# Altium schematic sheet Decoupling_caps.SchDoc: SVPXFMC Carrier 3U
size A4; CheckedBy: \; Author: G.Kasprowicz; CompanyName: ISE; DrawnBy: T.Przywozki; Organization: WUT ISE; Address1: Warsaw University of Technology; Address2: Nowowiejska 15/19 00-665 Warsaw; Revision: 1.0.; SheetNumber: 3; SheetTotal: 20; Projet: SVPXFMC Carrier 3U; ModifiedBy: -; CreateDate: XX/XX/XXXX; CheckedDate: -; Title2: Decoupling Caps; DivGrp: ISE; Designer: G. Kasprowicz; Project: SVPXFMC Carrier 3U
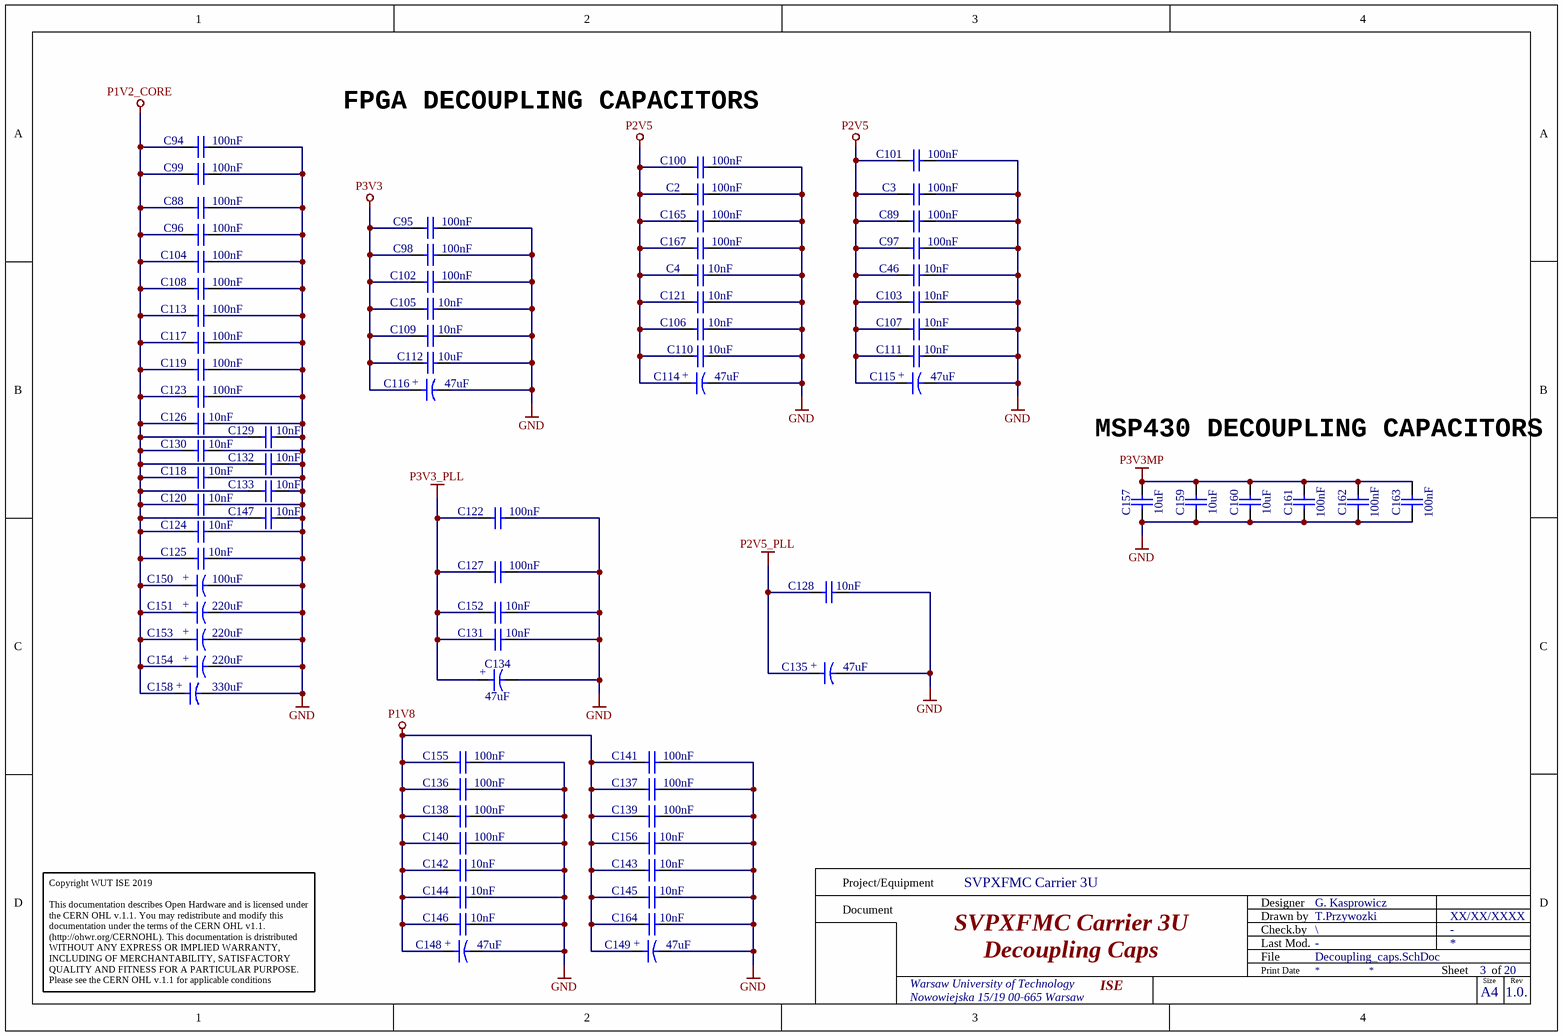
[diagram p0: Decoupling_caps.SchDoc]

## Parts
C2  100nF  [CAPC0603X33N]
C3  100nF  [CAPC0603X33N]
C4  10nF  [CAPC0603X33N]
C46  10nF  [CAPC0603X33N]
C88  100nF  [CAPC0603X33N]
C89  100nF  [CAPC0603X33N]
C94  100nF  [CAPC0603X33N]
C95  100nF  [CAPC0603X33N]
C96  100nF  [CAPC0603X33N]
C97  100nF  [CAPC0603X33N]
C98  100nF  [CAPC0603X33N]
C99  100nF  [CAPC0603X33N]
C100  100nF  [CAPC0603X33N]
C101  100nF  [CAPC0603X33N]
C102  100nF  [CAPC0603X33N]
C103  10nF  [CAPC0603X33N]
C104  100nF  [CAPC0603X33N]
C105  10nF  [CAPC0603X33N]
C106  10nF  [CAPC0603X33N]
C107  10nF  [CAPC0603X33N]
C108  100nF  [CAPC0603X33N]
C109  10nF  [CAPC0603X33N]
C110  10uF  [CAPC2012X135N]
C111  10nF  [CAPC0603X33N]
C112  10uF  [CAPC2012X135N]
C113  100nF  [CAPC0603X33N]
C114  47uF  [CAPMP3528X210N]
C115  47uF  [CAPMP3528X210N]
C116  47uF  [CAPMP3528X210N]
C117  100nF  [CAPC0603X33N]
C118  10nF  [CAPC0603X33N]
C119  100nF  [CAPC0603X33N]
C120  10nF  [CAPC0603X33N]
C121  10nF  [CAPC0603X33N]
C122  100nF  [CAPC0603X33N]
C123  100nF  [CAPC0603X33N]
C124  10nF  [CAPC0603X33N]
C125  10nF  [CAPC0603X33N]
C126  10nF  [CAPC0603X33N]
C127  100nF  [CAPC0603X33N]
C128  10nF  [CAPC0603X33N]
C129  10nF  [CAPC0603X33N]
C130  10nF  [CAPC0603X33N]
C131  10nF  [CAPC0603X33N]
C132  10nF  [CAPC0603X33N]
C133  10nF  [CAPC0603X33N]
C134  47uF  [CAPMP3528X210N]
C135  47uF  [CAPMP3528X210N]
C136  100nF  [CAPC0603X33N]
C137  100nF  [CAPC0603X33N]
C138  100nF  [CAPC0603X33N]
C139  100nF  [CAPC0603X33N]
C140  100nF  [CAPC0603X33N]
C141  100nF  [CAPC0603X33N]
C142  10nF  [CAPC0603X33N]
C143  10nF  [CAPC0603X33N]
C144  10nF  [CAPC0603X33N]
C145  10nF  [CAPC0603X33N]
C146  10nF  [CAPC0603X33N]
C147  10nF  [CAPC0603X33N]
C148  47uF  [CAPMP3528X210N]
C149  47uF  [CAPMP3528X210N]
C150  100uF  [CAPMP3528X210N]
C151  220uF  [CAPMP7343X310N]
C152  10nF  [CAPC0603X33N]
C153  220uF  [CAPMP7343X310N]
C154  220uF  [CAPMP7343X310N]
C155  100nF  [CAPC0603X33N]
C156  10nF  [CAPC0603X33N]
C157  10uF  [CAPC1608X80N]
C158  330uF  [CAPMP7343X310N]
C159  10uF  [CAPC1608X80N]
C160  10uF  [CAPC1608X80N]
C161  100nF  [CAPC1005X55N]
C162  100nF  [CAPC1005X55N]
C163  100nF  [CAPC1005X55N]
C164  10nF  [CAPC0603X33N]
C165  100nF  [CAPC0603X33N]
C167  100nF  [CAPC0603X33N]

## Nets
GND: C2.2 C3.2 C4.2 C46.2 C88.2 C89.2 C94.2 C95.2 C96.2 C97.2 C98.2 C99.2 C100.2 C101.2 C102.2 C103.2 C104.2 C105.2 C106.2 C107.2 C108.2 C109.2 C110.2 C111.2 C112.2 C113.2 C114.2 C115.2 C116.2 C117.2 C118.2 C119.2 C120.2 C121.2 C122.2 C123.2 C124.2 C125.2 C126.2 C127.2 C128.2 C129.2 C130.2 C131.2 C132.2 C133.2 C134.2 C135.2 C136.2 C137.2 C138.2 C139.2 C140.2 C141.2 C142.2 C143.2 C144.2 C145.2 C146.2 C147.2 C148.2 C149.2 C150.2 C151.2 C152.2 C153.2 C154.2 C155.2 C156.2 C157.1 C158.2 C159.1 C160.1 C161.1 C162.1 C163.1 C164.2 C165.2 C167.2
P1V2_CORE: C88.1 C94.1 C96.1 C99.1 C104.1 C108.1 C113.1 C117.1 C118.1 C119.1 C120.1 C123.1 C124.1 C125.1 C126.1 C129.1 C130.1 C132.1 C133.1 C147.1 C150.1 C151.1 C153.1 C154.1 C158.1
P1V8: C136.1 C137.1 C138.1 C139.1 C140.1 C141.1 C142.1 C143.1 C144.1 C145.1 C146.1 C148.1 C149.1 C155.1 C156.1 C164.1
P2V5: C2.1 C3.1 C4.1 C46.1 C89.1 C97.1 C100.1 C101.1 C103.1 C106.1 C107.1 C110.1 C111.1 C114.1 C115.1 C121.1 C165.1 C167.1
P2V5_PLL: C128.1 C135.1
P3V3: C95.1 C98.1 C102.1 C105.1 C109.1 C112.1 C116.1
P3V3_PLL: C122.1 C127.1 C131.1 C134.1 C152.1
P3V3MP: C157.2 C159.2 C160.2 C161.2 C162.2 C163.2

## Notes on the sheet
- FPGA DECOUPLING CAPACITORS
- MSP430 DECOUPLING CAPACITORS
- Project/Equipment
- Document
- Designer
- Drawn by
- Check.by
- Copyright WUT ISE 2019
  This documentation describes Open Hardware and is licensed under the CERN OHL v.1.1. You may redistribute and modify this documentation under the terms of the CERN OHL v1.1.
  (http://ohwr.org/CERNOHL). This documentation is dristributed WITHOUT ANY EXPRESS OR IMPLIED WARRANTY, INCLUDING OF MERCHANTABILITY, SATISFACTORY QUALITY AND FITNESS FOR A PARTICULAR PURPOSE. Please see the CERN OHL v.1.1 for applicable conditions
- File
- Last Mod.
- Print Date
- Sheet
- Size
- A4
- of
- Rev
- (in symbol CTE3528-12_47UF_10V_20%_PANASONIC_TPB) +
- (in symbol CTE3528-21_100UF_6.3V_10%) +
- (in symbol CTE7343-31_220UF_6.3V_20%_LESR0009_KEMET_T520) +
- (in symbol CTE7343-31_330UF_6.3V_20%_LESR0025_KEMET_T520) +

## Library data of the parts
C2 C3 C88 C89 C94-C102 C104 C108 C113 C117 C119 C122 C123 C127 C136-C141 C155 C165 C167 = CC0201_100NF_6.3V_10%_X5R: Non-polarised capacitor; Manufacturer: GENERIC; Part Description: SMD Multilayer Chip Ceramic Capacitor; Manufacturer1 Part Number: 02016D104KAT2A; Voltage: 6.3V; TC: X5R; Tolerance: ±10%; Part Number: CC0201_100NF_6.3V_10%_X5R; Component Kind: Standard; Component Type: Standard; Pin Count: 2; Value: 100nF; Status: Not Recommended; Manufacturer Part Number: CC0201_100NF_6.3V_10%_X5R; Case: 0201; Mounted: Yes; Socket: No; SMD: Yes; Sense: No; Manufacturer1 Example: AVX; Manufacturer1 ComponentHeight: 0.33mm; HelpURL: \\cern.ch\dfs\Applications\Altium\Datasheets\CC0201_X5R_AVX.pdf; Author: CERN DEM JLC; CreateDate: 03/12/2007; LatestRevisionDate: 03/12/2007
C4 C46 C103 C105-C107 C109 C111 C118 C120 C121 C124-C126 C128-C133 C142-C147 C152 C156 C164 = CC0201_10NF_10V_10%_X5R: Non-polarised capacitor; Manufacturer: GENERIC; Part Description: SMD Multilayer Chip Ceramic Capacitor; Manufacturer1 Part Number: 0201ZD103KAT2A; Voltage: 10V; TC: X5R; Tolerance: ±10%; Part Number: CC0201_10NF_10V_10%_X5R; Component Kind: Standard; Component Type: Standard; Pin Count: 2; Value: 10nF; Status: Not Recommended; Manufacturer Part Number: CC0201_10NF_10V_10%_X5R; Case: 0201; Mounted: Yes; Socket: No; SMD: Yes; Sense: No; Manufacturer1 Example: AVX; Manufacturer1 ComponentHeight: 0.33mm; HelpURL: \\cern.ch\dfs\Applications\Altium\Datasheets\CC0201_X5R_AVX.pdf; Author: CERN DEM JLC; CreateDate: 03/12/2007; LatestRevisionDate: 03/12/2007
C110 C112 = CC0805_10UF_16V_10%_X5R: Non-polarised capacitor; Part Description: SMD Multilayer Chip Ceramic Capacitor; Manufacturer: GENERIC; Manufacturer1 Part Number: C0805C106K4PAC; Voltage: 16V; TC: X5R; Tolerance: ±10%; Part Number: CC0805_10UF_16V_10%_X5R; Component Kind: Standard; Component Type: Standard; Pin Count: 2; Value: 10uF; Status: Preferred; Manufacturer Part Number: CC0805_10UF_16V_10%_X5R; Case: 0805; Mounted: Yes; Socket: No; SMD: Yes; Sense: No; Manufacturer1 Example: KEMET; Manufacturer1 ComponentHeight: 1.4mm; HelpURL: \\cern.ch\dfs\Applications\Altium\Datasheets\CC1206_X5R_KEMET.pdf; Author: CERN DEM JLC; CreateDate: 03/12/2007; LatestRevisionDate: 03/12/2007
C114-C116 C134 C135 C148 C149 = CTE3528-12_47UF_10V_20%_PANASONIC_TPB: Polarised capacitor; Part Description: ESR 0R07 Tantalum Solid Capacitor with Conductive Polymer; Manufacturer Part Number: 10TPB47M; Voltage: 10V; Tolerance: ±20%; Part Number: CTE3528-12_47UF_10V_20%_PANASONIC_TPB; Component Kind: Standard; Component Type: Standard; Pin Count: 2; Value: 47uF; Status: None; Manufacturer: PANASONIC; Case: B; Mounted: Yes; Socket: No; SMD: Yes; Sense: No; ComponentHeight: 2.1mm; HelpURL: \\cern.ch\dfs\Applications\Altium\Datasheets\CTE_PANASONIC_TPB.pdf; Author: CERN DEM JLC; CreateDate: 01/09/2014; LatestRevisionDate: 01/09/2014
C150 = CTE3528-21_100UF_6.3V_10%: Polarised capacitor; Part Description: Solid Tantalum Chip Capacitor; Manufacturer: GENERIC; Manufacturer1 Part Number: TAJB107K006R; Voltage: 6.3V; Tolerance: ±10%; Part Number: CTE3528-21_100UF_6.3V_10%; Component Kind: Standard; Component Type: Standard; Pin Count: 2; Value: 100uF; Status: Preferred; Manufacturer Part Number: CTE3528-21_100UF_6.3V_10%; Case: B; Mounted: Yes; Socket: No; SMD: Yes; Sense: No; HelpURL: \\cern.ch\dfs\Applications\Altium\Datasheets\CTE_AVX_TAJ.pdf; Author: CERN DEM JLC; CreateDate: 03.12.2007; LatestRevisionDate: 03.12.2007; Manufacturer1 Example: AVX; Manufacturer1 ComponentHeight: 2.1mm
C151 C153 C154 = CTE7343-31_220UF_6.3V_20%_LESR0009_KEMET_T520: Polarised capacitor; Part Description: Low ESR 0R009 Tantalum Chip Capacitor; Manufacturer: KEMET; Manufacturer Part Number: T520D227M006ATE009; Voltage: 6.3V; Tolerance: ±20%; Part Number: CTE7343-31_220UF_6.3V_20%_LESR0009_KEMET_T520; Component Kind: Standard; Component Type: Standard; Pin Count: 2; Value: 220uF; Status: Preferred; Case: D; Mounted: Yes; Socket: No; SMD: Yes; Sense: No; ComponentHeight: 3.1mm; HelpURL: \\cern.ch\dfs\Applications\Altium\Datasheets\CTE-LESR_KEMET_T520.pdf; Author: CERN DEM JLC; CreateDate: 25.10.2012; LatestRevisionDate: 25.10.2012
C157 C159 C160 = CC0603_10UF_16V_20%_X5R: Non-polarised capacitor; Part Description: SMD Multilayer Chip Ceramic Capacitor; Manufacturer: GENERIC; Manufacturer1 Part Number: GRM188R61C106MA73D; Voltage: 16V; TC: X5R; Tolerance: ±20%; Part Number: CC0603_10UF_16V_20%_X5R; Component Kind: Standard; Component Type: Standard; Pin Count: 2; Value: 10uF; Status: None; Manufacturer Part Number: CC0603_10UF_16V_20%_X5R; Case: 0603; Mounted: Yes; Socket: No; SMD: Yes; Sense: No; Manufacturer1 Example: MURATA; Manufacturer1 ComponentHeight: 0.8mm; HelpURL: \\cern.ch\dfs\Applications\Altium\Datasheets\CC0603_X5R_MURATA_GRM.pdf; Author: CERN DEM MR; CreateDate: 02.03.2016; LatestRevisionDate: 02.03.2016
C158 = CTE7343-31_330UF_6.3V_20%_LESR0025_KEMET_T520: Polarised capacitor; Manufacturer: KEMET; Part Description: Low ESR 0R025 Tantalum Chip Capacitor; Manufacturer Part Number: T520D337M006ATE025; Voltage: 6.3V; Tolerance: ±20%; Part Number: CTE7343-31_330UF_6.3V_20%_LESR0025_KEMET_T520; Component Kind: Standard; Component Type: Standard; Pin Count: 2; Value: 330uF; Status: None; Case: D; Mounted: Yes; Socket: No; SMD: Yes; Sense: No; ComponentHeight: 3.1mm; HelpURL: \\cern.ch\dfs\Applications\Altium\Datasheets\CTE-LESR_KEMET_T520.pdf; Author: CERN DEM JLC; CreateDate: 20/10/2010; LatestRevisionDate: 20/10/2010
C161-C163 = CC0402_100NF_25V_10%_X7R_YUDEN_TMK105B7104KVHF: Non-polarised capacitor; Part Description: SMD Multilayer Chip Ceramic Capacitor (High Dielectric Type) for Automotive / Industrial Applications; Manufacturer: TAIYO YUDEN; Voltage: 25V; TC: X7R; Tolerance: ±10%; Part Number: CC0402_100NF_25V_10%_X7R_YUDEN_TMK105B7104KVHF; Component Kind: Standard; Component Type: Standard; Pin Count: 2; Value: 100nF; Status: Not Recommended; Manufacturer Part Number: TMK105B7104KVHF; Case: 0402; Mounted: Yes; Socket: No; SMD: Yes; Sense: No; HelpURL: \\cern.ch\dfs\Applications\Altium\Datasheets\CC0402_TAIYO-YUDEN_TMK105B7104KVHF.pdf; Author: CERN DEM JLC; CreateDate: 10/05/2017; LatestRevisionDate: 10/05/2017; ComponentHeight: 0.55mm